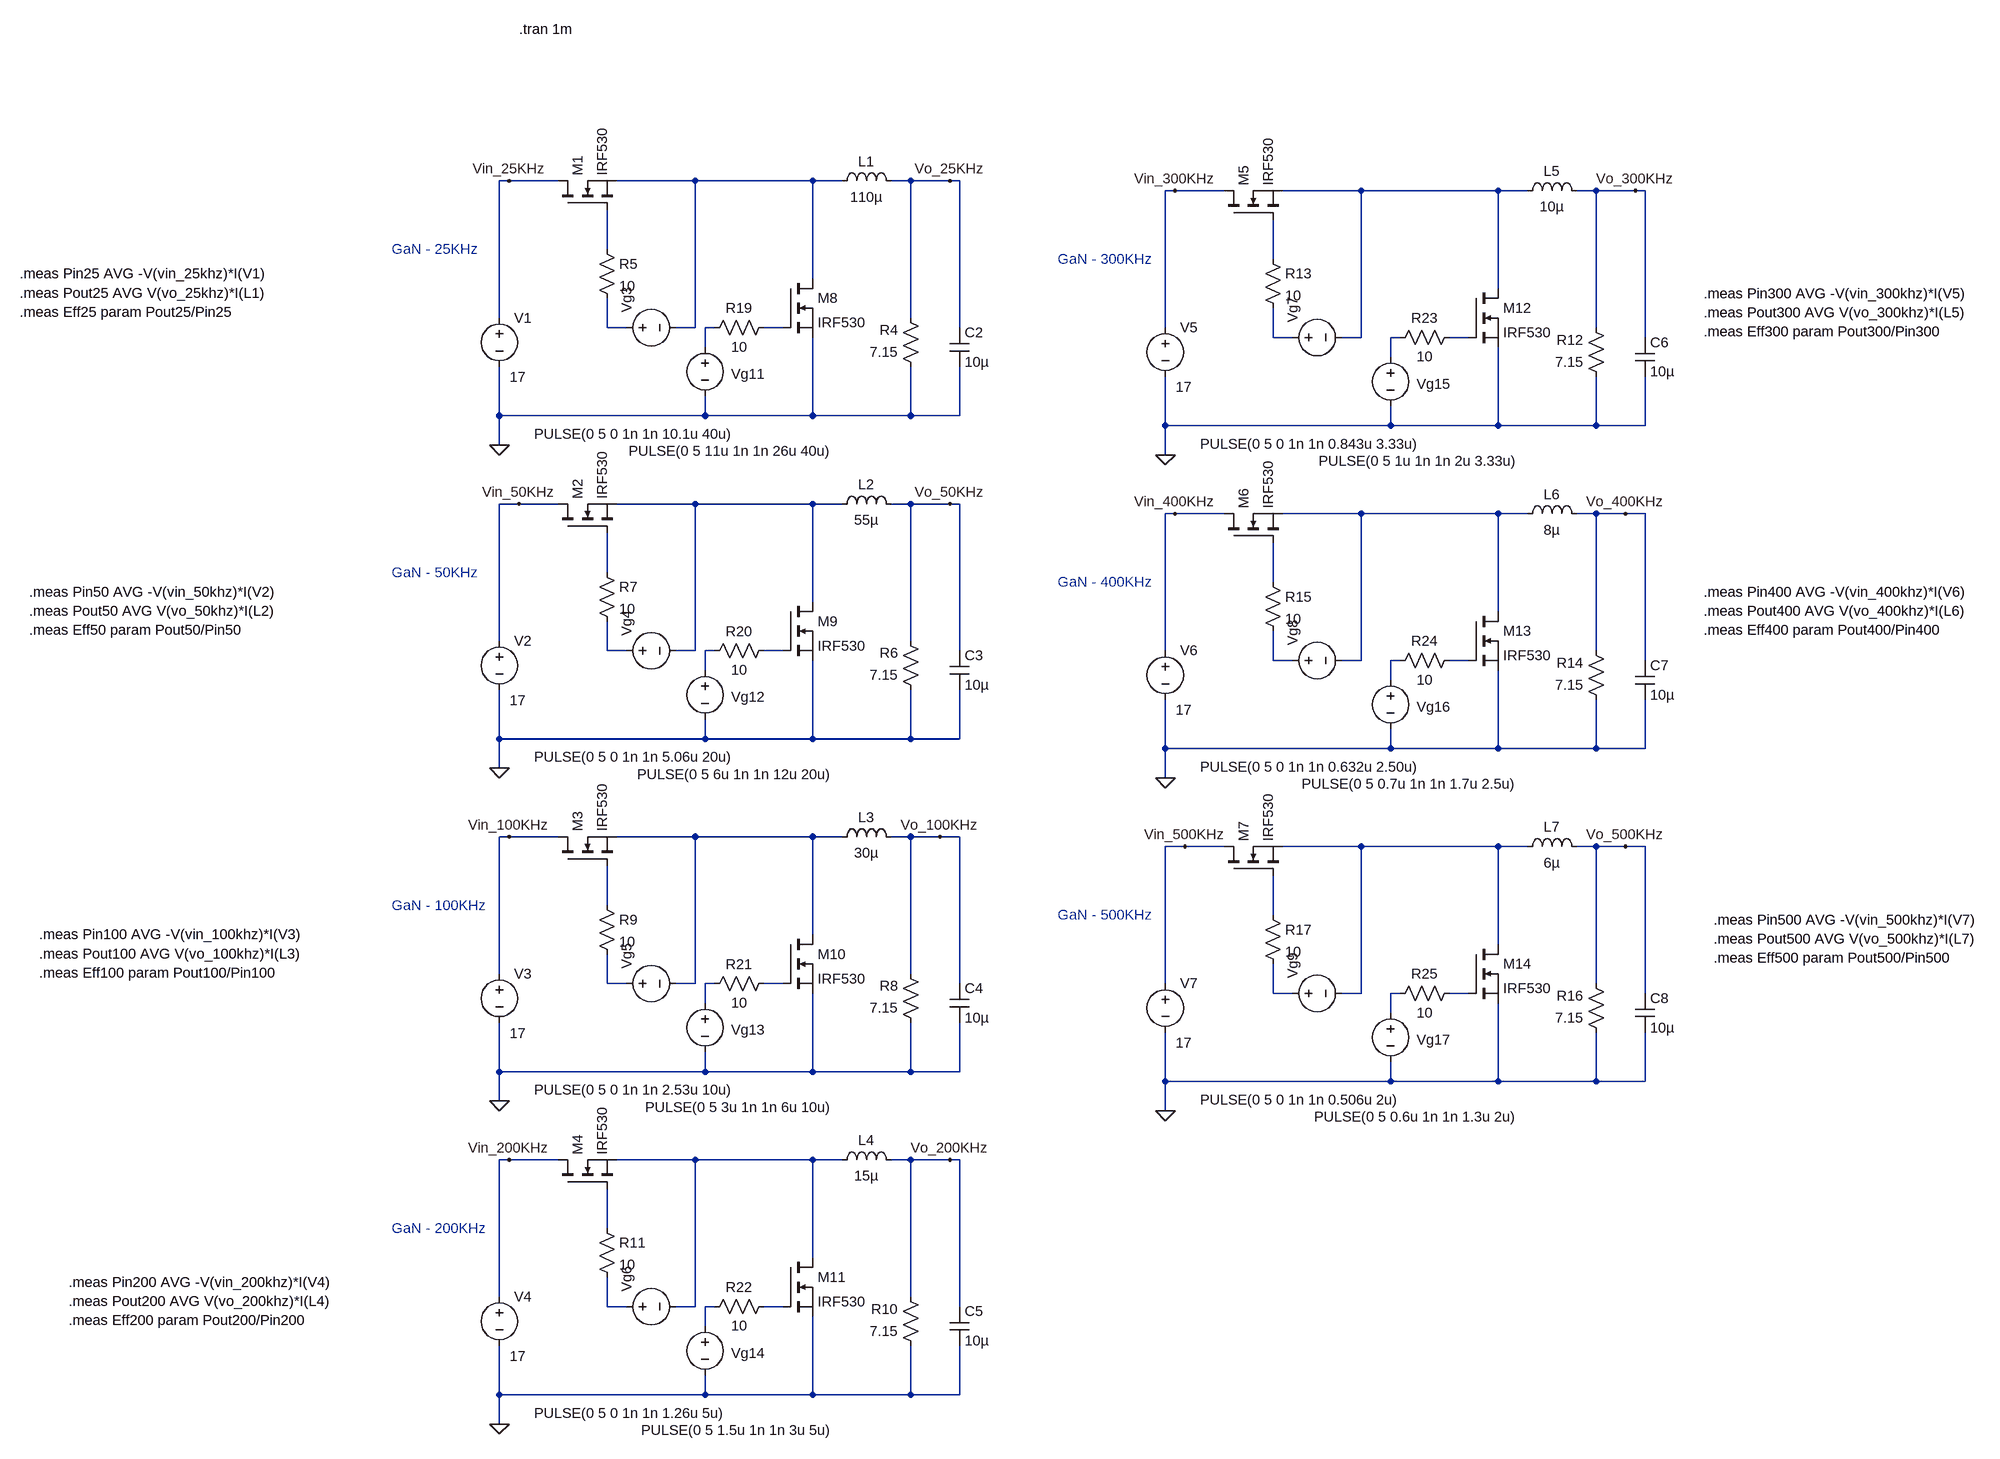
[diagram p0: schematic 2xIRF530.asc]
2xIRF530.asc, the LTspice schematic file:
Version 4
SHEET 1 3084 1916
WIRE 640 -144 624 -144
WIRE 720 -144 640 -144
WIRE 944 -144 816 -144
WIRE 1136 -144 944 -144
WIRE 1184 -144 1136 -144
WIRE 1296 -144 1264 -144
WIRE 1360 -144 1296 -144
WIRE 1376 -144 1360 -144
WIRE 1728 -128 1712 -128
WIRE 1808 -128 1728 -128
WIRE 2032 -128 1904 -128
WIRE 2256 -128 2032 -128
WIRE 2304 -128 2256 -128
WIRE 2416 -128 2384 -128
WIRE 2480 -128 2416 -128
WIRE 2496 -128 2480 -128
WIRE 800 -32 800 -96
WIRE 1888 -16 1888 -80
WIRE 1136 16 1136 -144
WIRE 2256 32 2256 -128
WIRE 624 80 624 -144
WIRE 1296 80 1296 -144
WIRE 800 96 800 48
WIRE 832 96 800 96
WIRE 944 96 944 -144
WIRE 944 96 912 96
WIRE 976 96 960 96
WIRE 1088 96 1056 96
WIRE 1376 96 1376 -144
WIRE 1712 96 1712 -128
WIRE 2416 96 2416 -128
WIRE 1888 112 1888 64
WIRE 1920 112 1888 112
WIRE 2032 112 2032 -128
WIRE 2032 112 2000 112
WIRE 2096 112 2080 112
WIRE 2208 112 2176 112
WIRE 2496 112 2496 -128
WIRE 960 128 960 96
WIRE 2080 144 2080 112
WIRE 624 240 624 160
WIRE 960 240 960 208
WIRE 960 240 624 240
WIRE 1136 240 1136 112
WIRE 1136 240 960 240
WIRE 1296 240 1296 160
WIRE 1296 240 1136 240
WIRE 1376 240 1376 160
WIRE 1376 240 1296 240
WIRE 1712 256 1712 176
WIRE 2080 256 2080 224
WIRE 2080 256 1712 256
WIRE 2256 256 2256 128
WIRE 2256 256 2080 256
WIRE 2416 256 2416 176
WIRE 2416 256 2256 256
WIRE 2496 256 2496 176
WIRE 2496 256 2416 256
WIRE 624 288 624 240
WIRE 1712 304 1712 256
WIRE 656 384 624 384
WIRE 720 384 656 384
WIRE 944 384 816 384
WIRE 1136 384 944 384
WIRE 1184 384 1136 384
WIRE 1296 384 1264 384
WIRE 1360 384 1296 384
WIRE 1376 384 1360 384
WIRE 1728 400 1712 400
WIRE 1808 400 1728 400
WIRE 2032 400 1904 400
WIRE 2256 400 2032 400
WIRE 2304 400 2256 400
WIRE 2416 400 2384 400
WIRE 2464 400 2416 400
WIRE 2496 400 2464 400
WIRE 800 496 800 432
WIRE 1888 512 1888 448
WIRE 1136 544 1136 384
WIRE 2256 560 2256 400
WIRE 624 608 624 384
WIRE 1296 608 1296 384
WIRE 800 624 800 576
WIRE 832 624 800 624
WIRE 944 624 944 384
WIRE 944 624 912 624
WIRE 976 624 960 624
WIRE 1088 624 1056 624
WIRE 1376 624 1376 384
WIRE 1712 624 1712 400
WIRE 2416 624 2416 400
WIRE 1888 640 1888 592
WIRE 1920 640 1888 640
WIRE 2032 640 2032 400
WIRE 2032 640 2000 640
WIRE 2096 640 2080 640
WIRE 2208 640 2176 640
WIRE 2496 640 2496 400
WIRE 960 656 960 624
WIRE 2080 672 2080 640
WIRE 624 768 624 688
WIRE 960 768 960 736
WIRE 960 768 624 768
WIRE 1136 768 1136 640
WIRE 1136 768 960 768
WIRE 1296 768 1296 688
WIRE 1296 768 1136 768
WIRE 1376 768 1376 688
WIRE 1376 768 1296 768
WIRE 1712 784 1712 704
WIRE 2080 784 2080 752
WIRE 2080 784 1712 784
WIRE 2256 784 2256 656
WIRE 2256 784 2080 784
WIRE 2416 784 2416 704
WIRE 2416 784 2256 784
WIRE 2496 784 2496 704
WIRE 2496 784 2416 784
WIRE 624 816 624 768
WIRE 1712 832 1712 784
WIRE 640 928 624 928
WIRE 720 928 640 928
WIRE 944 928 816 928
WIRE 1136 928 944 928
WIRE 1184 928 1136 928
WIRE 1296 928 1264 928
WIRE 1344 928 1296 928
WIRE 1376 928 1344 928
WIRE 1744 944 1712 944
WIRE 1808 944 1744 944
WIRE 2032 944 1904 944
WIRE 2256 944 2032 944
WIRE 2304 944 2256 944
WIRE 2416 944 2384 944
WIRE 2464 944 2416 944
WIRE 2496 944 2464 944
WIRE 800 1040 800 976
WIRE 1888 1056 1888 992
WIRE 1136 1088 1136 928
WIRE 2256 1104 2256 944
WIRE 624 1152 624 928
WIRE 1296 1152 1296 928
WIRE 800 1168 800 1120
WIRE 832 1168 800 1168
WIRE 944 1168 944 928
WIRE 944 1168 912 1168
WIRE 976 1168 960 1168
WIRE 1088 1168 1056 1168
WIRE 1376 1168 1376 928
WIRE 1712 1168 1712 944
WIRE 2416 1168 2416 944
WIRE 1888 1184 1888 1136
WIRE 1920 1184 1888 1184
WIRE 2032 1184 2032 944
WIRE 2032 1184 2000 1184
WIRE 2096 1184 2080 1184
WIRE 2208 1184 2176 1184
WIRE 2496 1184 2496 944
WIRE 960 1200 960 1168
WIRE 2080 1216 2080 1184
WIRE 624 1312 624 1232
WIRE 960 1312 960 1280
WIRE 960 1312 624 1312
WIRE 1136 1312 1136 1184
WIRE 1136 1312 960 1312
WIRE 1296 1312 1296 1232
WIRE 1296 1312 1136 1312
WIRE 1376 1312 1376 1232
WIRE 1376 1312 1296 1312
WIRE 1712 1328 1712 1248
WIRE 2080 1328 2080 1296
WIRE 2080 1328 1712 1328
WIRE 2256 1328 2256 1200
WIRE 2256 1328 2080 1328
WIRE 2416 1328 2416 1248
WIRE 2416 1328 2256 1328
WIRE 2496 1328 2496 1248
WIRE 2496 1328 2416 1328
WIRE 624 1360 624 1312
WIRE 1712 1376 1712 1328
WIRE 640 1456 624 1456
WIRE 720 1456 640 1456
WIRE 944 1456 816 1456
WIRE 1136 1456 944 1456
WIRE 1184 1456 1136 1456
WIRE 1296 1456 1264 1456
WIRE 1360 1456 1296 1456
WIRE 1376 1456 1360 1456
WIRE 800 1568 800 1504
WIRE 1136 1616 1136 1456
WIRE 624 1680 624 1456
WIRE 1296 1680 1296 1456
WIRE 800 1696 800 1648
WIRE 832 1696 800 1696
WIRE 944 1696 944 1456
WIRE 944 1696 912 1696
WIRE 976 1696 960 1696
WIRE 1088 1696 1056 1696
WIRE 1376 1696 1376 1456
WIRE 960 1728 960 1696
WIRE 624 1840 624 1760
WIRE 960 1840 960 1808
WIRE 960 1840 624 1840
WIRE 1136 1840 1136 1712
WIRE 1136 1840 960 1840
WIRE 1296 1840 1296 1760
WIRE 1296 1840 1136 1840
WIRE 1376 1840 1376 1760
WIRE 1376 1840 1296 1840
WIRE 624 1888 624 1840
FLAG 624 288 0
FLAG 624 816 0
FLAG 624 1360 0
FLAG 624 1888 0
FLAG 1712 304 0
FLAG 1712 832 0
FLAG 1712 1376 0
FLAG 1360 -144 Vo_25KHz
FLAG 1360 384 Vo_50KHz
FLAG 1344 928 Vo_100KHz
FLAG 1360 1456 Vo_200KHz
FLAG 2464 944 Vo_500KHz
FLAG 2464 400 Vo_400KHz
FLAG 2480 -128 Vo_300KHz
FLAG 640 -144 Vin_25KHz
FLAG 656 384 Vin_50KHz
FLAG 640 928 Vin_100KHz
FLAG 640 1456 Vin_200KHz
FLAG 1728 -128 Vin_300KHz
FLAG 1728 400 Vin_400KHz
FLAG 1744 944 Vin_500KHz
SYMBOL voltage 816 96 R270
WINDOW 3 -174 -135 VRight 2
WINDOW 123 0 0 Left 2
SYMATTR Value PULSE(0 5 0 1n 1n 10.1u 40u)
SYMATTR SpiceLine Rser=2
SYMATTR InstName Vg3
SYMBOL voltage 624 64 R0
WINDOW 123 0 0 Left 2
WINDOW 3 17 113 Left 2
SYMATTR Value 17
SYMATTR SpiceLine Rser=0
SYMATTR InstName V1
SYMBOL ind 1168 -128 R270
WINDOW 0 32 56 VTop 2
WINDOW 3 5 56 VBottom 2
SYMATTR InstName L1
SYMATTR Value 110µ
SYMBOL res 1312 176 R180
WINDOW 0 36 76 Left 2
WINDOW 3 36 40 Left 2
SYMATTR InstName R4
SYMATTR Value 7.15
SYMBOL cap 1360 96 R0
SYMATTR InstName C2
SYMATTR Value 10µ
SYMBOL res 784 -48 R0
SYMATTR InstName R5
SYMATTR Value 10
SYMBOL voltage 816 624 R270
WINDOW 3 -174 -135 VRight 2
WINDOW 123 0 0 Left 2
SYMATTR Value PULSE(0 5 0 1n 1n 5.06u 20u)
SYMATTR SpiceLine Rser=2
SYMATTR InstName Vg4
SYMBOL voltage 624 592 R0
WINDOW 123 0 0 Left 2
WINDOW 3 17 113 Left 2
SYMATTR Value 17
SYMATTR SpiceLine Rser=0
SYMATTR InstName V2
SYMBOL ind 1168 400 R270
WINDOW 0 32 56 VTop 2
WINDOW 3 5 56 VBottom 2
SYMATTR InstName L2
SYMATTR Value 55µ
SYMBOL res 1312 704 R180
WINDOW 0 36 76 Left 2
WINDOW 3 36 40 Left 2
SYMATTR InstName R6
SYMATTR Value 7.15
SYMBOL cap 1360 624 R0
SYMATTR InstName C3
SYMATTR Value 10µ
SYMBOL res 784 480 R0
SYMATTR InstName R7
SYMATTR Value 10
SYMBOL voltage 816 1168 R270
WINDOW 3 -174 -135 VRight 2
WINDOW 123 0 0 Left 2
SYMATTR Value PULSE(0 5 0 1n 1n 2.53u 10u)
SYMATTR SpiceLine Rser=2
SYMATTR InstName Vg5
SYMBOL voltage 624 1136 R0
WINDOW 123 0 0 Left 2
WINDOW 3 17 113 Left 2
SYMATTR Value 17
SYMATTR SpiceLine Rser=0
SYMATTR InstName V3
SYMBOL ind 1168 944 R270
WINDOW 0 32 56 VTop 2
WINDOW 3 5 56 VBottom 2
SYMATTR InstName L3
SYMATTR Value 30µ
SYMBOL res 1312 1248 R180
WINDOW 0 36 76 Left 2
WINDOW 3 36 40 Left 2
SYMATTR InstName R8
SYMATTR Value 7.15
SYMBOL cap 1360 1168 R0
SYMATTR InstName C4
SYMATTR Value 10µ
SYMBOL res 784 1024 R0
SYMATTR InstName R9
SYMATTR Value 10
SYMBOL voltage 816 1696 R270
WINDOW 3 -174 -135 VRight 2
WINDOW 123 0 0 Left 2
SYMATTR Value PULSE(0 5 0 1n 1n 1.26u 5u)
SYMATTR SpiceLine Rser=2
SYMATTR InstName Vg6
SYMBOL voltage 624 1664 R0
WINDOW 123 0 0 Left 2
WINDOW 3 17 113 Left 2
SYMATTR Value 17
SYMATTR SpiceLine Rser=0
SYMATTR InstName V4
SYMBOL ind 1168 1472 R270
WINDOW 0 32 56 VTop 2
WINDOW 3 5 56 VBottom 2
SYMATTR InstName L4
SYMATTR Value 15µ
SYMBOL res 1312 1776 R180
WINDOW 0 36 76 Left 2
WINDOW 3 36 40 Left 2
SYMATTR InstName R10
SYMATTR Value 7.15
SYMBOL cap 1360 1696 R0
SYMATTR InstName C5
SYMATTR Value 10µ
SYMBOL res 784 1552 R0
SYMATTR InstName R11
SYMATTR Value 10
SYMBOL voltage 1904 112 R270
WINDOW 3 -174 -135 VRight 2
WINDOW 123 0 0 Left 2
SYMATTR Value PULSE(0 5 0 1n 1n 0.843u 3.33u)
SYMATTR SpiceLine Rser=2
SYMATTR InstName Vg7
SYMBOL voltage 1712 80 R0
WINDOW 123 0 0 Left 2
WINDOW 3 17 113 Left 2
SYMATTR Value 17
SYMATTR SpiceLine Rser=0
SYMATTR InstName V5
SYMBOL ind 2288 -112 R270
WINDOW 0 32 56 VTop 2
WINDOW 3 5 56 VBottom 2
SYMATTR InstName L5
SYMATTR Value 10µ
SYMBOL res 2432 192 R180
WINDOW 0 36 76 Left 2
WINDOW 3 36 40 Left 2
SYMATTR InstName R12
SYMATTR Value 7.15
SYMBOL cap 2480 112 R0
SYMATTR InstName C6
SYMATTR Value 10µ
SYMBOL res 1872 -32 R0
SYMATTR InstName R13
SYMATTR Value 10
SYMBOL voltage 1904 640 R270
WINDOW 3 -174 -135 VRight 2
WINDOW 123 0 0 Left 2
SYMATTR Value PULSE(0 5 0 1n 1n 0.632u 2.50u)
SYMATTR SpiceLine Rser=2
SYMATTR InstName Vg8
SYMBOL voltage 1712 608 R0
WINDOW 123 0 0 Left 2
WINDOW 3 17 113 Left 2
SYMATTR Value 17
SYMATTR SpiceLine Rser=0
SYMATTR InstName V6
SYMBOL ind 2288 416 R270
WINDOW 0 32 56 VTop 2
WINDOW 3 5 56 VBottom 2
SYMATTR InstName L6
SYMATTR Value 8µ
SYMBOL res 2432 720 R180
WINDOW 0 36 76 Left 2
WINDOW 3 36 40 Left 2
SYMATTR InstName R14
SYMATTR Value 7.15
SYMBOL cap 2480 640 R0
SYMATTR InstName C7
SYMATTR Value 10µ
SYMBOL res 1872 496 R0
SYMATTR InstName R15
SYMATTR Value 10
SYMBOL voltage 1904 1184 R270
WINDOW 3 -174 -135 VRight 2
WINDOW 123 0 0 Left 2
SYMATTR Value PULSE(0 5 0 1n 1n 0.506u 2u)
SYMATTR SpiceLine Rser=2
SYMATTR InstName Vg9
SYMBOL voltage 1712 1152 R0
WINDOW 123 0 0 Left 2
WINDOW 3 17 113 Left 2
SYMATTR Value 17
SYMATTR SpiceLine Rser=0
SYMATTR InstName V7
SYMBOL ind 2288 960 R270
WINDOW 0 32 56 VTop 2
WINDOW 3 5 56 VBottom 2
SYMATTR InstName L7
SYMATTR Value 6µ
SYMBOL res 2432 1264 R180
WINDOW 0 36 76 Left 2
WINDOW 3 36 40 Left 2
SYMATTR InstName R16
SYMATTR Value 7.15
SYMBOL cap 2480 1184 R0
SYMATTR InstName C8
SYMATTR Value 10µ
SYMBOL res 1872 1040 R0
SYMATTR InstName R17
SYMATTR Value 10
SYMBOL voltage 960 112 R0
WINDOW 3 213 186 Right 2
WINDOW 123 0 0 Left 2
WINDOW 0 43 60 Left 2
SYMATTR Value PULSE(0 5 11u 1n 1n 26u 40u)
SYMATTR InstName Vg11
SYMATTR SpiceLine Rser=2
SYMBOL res 1072 80 R90
WINDOW 0 0 56 VBottom 2
WINDOW 3 32 56 VTop 2
SYMATTR InstName R19
SYMATTR Value 10
SYMBOL voltage 960 640 R0
WINDOW 3 213 186 Right 2
WINDOW 123 0 0 Left 2
WINDOW 0 43 60 Left 2
SYMATTR Value PULSE(0 5 6u 1n 1n 12u 20u)
SYMATTR InstName Vg12
SYMATTR SpiceLine Rser=2
SYMBOL res 1072 608 R90
WINDOW 0 0 56 VBottom 2
WINDOW 3 32 56 VTop 2
SYMATTR InstName R20
SYMATTR Value 10
SYMBOL voltage 960 1184 R0
WINDOW 3 213 186 Right 2
WINDOW 123 0 0 Left 2
WINDOW 0 43 60 Left 2
SYMATTR Value PULSE(0 5 3u 1n 1n 6u 10u)
SYMATTR InstName Vg13
SYMATTR SpiceLine Rser=2
SYMBOL res 1072 1152 R90
WINDOW 0 0 56 VBottom 2
WINDOW 3 32 56 VTop 2
SYMATTR InstName R21
SYMATTR Value 10
SYMBOL voltage 960 1712 R0
WINDOW 3 213 186 Right 2
WINDOW 123 0 0 Left 2
WINDOW 0 43 60 Left 2
SYMATTR Value PULSE(0 5 1.5u 1n 1n 3u 5u)
SYMATTR InstName Vg14
SYMATTR SpiceLine Rser=2
SYMBOL res 1072 1680 R90
WINDOW 0 0 56 VBottom 2
WINDOW 3 32 56 VTop 2
SYMATTR InstName R22
SYMATTR Value 10
SYMBOL voltage 2080 128 R0
WINDOW 3 213 186 Right 2
WINDOW 123 0 0 Left 2
WINDOW 0 43 60 Left 2
SYMATTR Value PULSE(0 5 1u 1n 1n 2u 3.33u)
SYMATTR InstName Vg15
SYMATTR SpiceLine Rser=2
SYMBOL res 2192 96 R90
WINDOW 0 0 56 VBottom 2
WINDOW 3 32 56 VTop 2
SYMATTR InstName R23
SYMATTR Value 10
SYMBOL voltage 2080 656 R0
WINDOW 3 213 186 Right 2
WINDOW 123 0 0 Left 2
WINDOW 0 43 60 Left 2
SYMATTR Value PULSE(0 5 0.7u 1n 1n 1.7u 2.5u)
SYMATTR InstName Vg16
SYMATTR SpiceLine Rser=2
SYMBOL res 2192 624 R90
WINDOW 0 0 56 VBottom 2
WINDOW 3 32 56 VTop 2
SYMATTR InstName R24
SYMATTR Value 10
SYMBOL voltage 2080 1200 R0
WINDOW 3 213 186 Right 2
WINDOW 123 0 0 Left 2
WINDOW 0 43 60 Left 2
SYMATTR Value PULSE(0 5 0.6u 1n 1n 1.3u 2u)
SYMATTR InstName Vg17
SYMATTR SpiceLine Rser=2
SYMBOL res 2192 1168 R90
WINDOW 0 0 56 VBottom 2
WINDOW 3 32 56 VTop 2
SYMATTR InstName R25
SYMATTR Value 10
SYMBOL nmos 720 -96 R270
SYMATTR InstName M1
SYMATTR Value IRF530
SYMBOL nmos 720 432 R270
SYMATTR InstName M2
SYMATTR Value IRF530
SYMBOL nmos 720 976 R270
SYMATTR InstName M3
SYMATTR Value IRF530
SYMBOL nmos 720 1504 R270
SYMATTR InstName M4
SYMATTR Value IRF530
SYMBOL nmos 1808 -80 R270
SYMATTR InstName M5
SYMATTR Value IRF530
SYMBOL nmos 1808 448 R270
SYMATTR InstName M6
SYMATTR Value IRF530
SYMBOL nmos 1808 992 R270
SYMATTR InstName M7
SYMATTR Value IRF530
SYMBOL nmos 1088 16 R0
SYMATTR InstName M8
SYMATTR Value IRF530
SYMBOL nmos 1088 544 R0
SYMATTR InstName M9
SYMATTR Value IRF530
SYMBOL nmos 1088 1088 R0
SYMATTR InstName M10
SYMATTR Value IRF530
SYMBOL nmos 1088 1616 R0
SYMATTR InstName M11
SYMATTR Value IRF530
SYMBOL nmos 2208 32 R0
SYMATTR InstName M12
SYMATTR Value IRF530
SYMBOL nmos 2208 560 R0
SYMATTR InstName M13
SYMATTR Value IRF530
SYMBOL nmos 2208 1104 R0
SYMATTR InstName M14
SYMATTR Value IRF530
TEXT 656 -392 Left 2 !.tran 1m
TEXT 448 -32 Left 2 ;GaN - 25KHz
TEXT 448 496 Left 2 ;GaN - 50KHz
TEXT 448 1040 Left 2 ;GaN - 100KHz
TEXT 448 1568 Left 2 ;GaN - 200KHz
TEXT 1536 -16 Left 2 ;GaN - 300KHz
TEXT 1536 512 Left 2 ;GaN - 400KHz
TEXT 1536 1056 Left 2 ;GaN - 500KHz
TEXT -160 8 Left 2 !.meas Pin25 AVG -V(vin_25khz)*I(V1)\n.meas Pout25 AVG V(vo_25khz)*I(L1)\n.meas Eff25 param Pout25/Pin25
TEXT -144 528 Left 2 !.meas Pin50 AVG -V(vin_50khz)*I(V2)\n.meas Pout50 AVG V(vo_50khz)*I(L2)\n.meas Eff50 param Pout50/Pin50
TEXT -128 1088 Left 2 !.meas Pin100 AVG -V(vin_100khz)*I(V3)\n.meas Pout100 AVG V(vo_100khz)*I(L3)\n.meas Eff100 param Pout100/Pin100
TEXT -80 1656 Left 2 !.meas Pin200 AVG -V(vin_200khz)*I(V4)\n.meas Pout200 AVG V(vo_200khz)*I(L4)\n.meas Eff200 param Pout200/Pin200
TEXT 2592 40 Left 2 !.meas Pin300 AVG -V(vin_300khz)*I(V5)\n.meas Pout300 AVG V(vo_300khz)*I(L5)\n.meas Eff300 param Pout300/Pin300
TEXT 2592 528 Left 2 !.meas Pin400 AVG -V(vin_400khz)*I(V6)\n.meas Pout400 AVG V(vo_400khz)*I(L6)\n.meas Eff400 param Pout400/Pin400
TEXT 2608 1064 Left 2 !.meas Pin500 AVG -V(vin_500khz)*I(V7)\n.meas Pout500 AVG V(vo_500khz)*I(L7)\n.meas Eff500 param Pout500/Pin500

The netlist it stands for:
* 2xIRF530.asc
Vg3 N005 N001 PULSE(0 5 0 1n 1n 10.1u 40u) Rser=2
V1 Vin_25KHz 0 17 Rser=0
L1 N001 Vo_25KHz 110µ
R4 0 Vo_25KHz 7.15
C2 Vo_25KHz 0 10µ
R5 N003 N005 10
Vg4 N015 N011 PULSE(0 5 0 1n 1n 5.06u 20u) Rser=2
V2 Vin_50KHz 0 17 Rser=0
L2 N011 Vo_50KHz 55µ
R6 0 Vo_50KHz 7.15
C3 Vo_50KHz 0 10µ
R7 N013 N015 10
Vg5 N025 N021 PULSE(0 5 0 1n 1n 2.53u 10u) Rser=2
V3 Vin_100KHz 0 17 Rser=0
L3 N021 Vo_100KHz 30µ
R8 0 Vo_100KHz 7.15
C4 Vo_100KHz 0 10µ
R9 N023 N025 10
Vg6 N033 N031 PULSE(0 5 0 1n 1n 1.26u 5u) Rser=2
V4 Vin_200KHz 0 17 Rser=0
L4 N031 Vo_200KHz 15µ
R10 0 Vo_200KHz 7.15
C5 Vo_200KHz 0 10µ
R11 N032 N033 10
Vg7 N008 N002 PULSE(0 5 0 1n 1n 0.843u 3.33u) Rser=2
V5 Vin_300KHz 0 17 Rser=0
L5 N002 Vo_300KHz 10µ
R12 0 Vo_300KHz 7.15
C6 Vo_300KHz 0 10µ
R13 N004 N008 10
Vg8 N018 N012 PULSE(0 5 0 1n 1n 0.632u 2.50u) Rser=2
V6 Vin_400KHz 0 17 Rser=0
L6 N012 Vo_400KHz 8µ
R14 0 Vo_400KHz 7.15
C7 Vo_400KHz 0 10µ
R15 N014 N018 10
Vg9 N028 N022 PULSE(0 5 0 1n 1n 0.506u 2u) Rser=2
V7 Vin_500KHz 0 17 Rser=0
L7 N022 Vo_500KHz 6µ
R16 0 Vo_500KHz 7.15
C8 Vo_500KHz 0 10µ
R17 N024 N028 10
Vg11 N006 0 PULSE(0 5 11u 1n 1n 26u 40u) Rser=2
R19 N007 N006 10
Vg12 N016 0 PULSE(0 5 6u 1n 1n 12u 20u) Rser=2
R20 N017 N016 10
Vg13 N026 0 PULSE(0 5 3u 1n 1n 6u 10u) Rser=2
R21 N027 N026 10
Vg14 N034 0 PULSE(0 5 1.5u 1n 1n 3u 5u) Rser=2
R22 N035 N034 10
Vg15 N009 0 PULSE(0 5 1u 1n 1n 2u 3.33u) Rser=2
R23 N010 N009 10
Vg16 N019 0 PULSE(0 5 0.7u 1n 1n 1.7u 2.5u) Rser=2
R24 N020 N019 10
Vg17 N029 0 PULSE(0 5 0.6u 1n 1n 1.3u 2u) Rser=2
R25 N030 N029 10
M1 Vin_25KHz N003 N001 N001 IRF530
M2 Vin_50KHz N013 N011 N011 IRF530
M3 Vin_100KHz N023 N021 N021 IRF530
M4 Vin_200KHz N032 N031 N031 IRF530
M5 Vin_300KHz N004 N002 N002 IRF530
M6 Vin_400KHz N014 N012 N012 IRF530
M7 Vin_500KHz N024 N022 N022 IRF530
M8 N001 N007 0 0 IRF530
M9 N011 N017 0 0 IRF530
M10 N021 N027 0 0 IRF530
M11 N031 N035 0 0 IRF530
M12 N002 N010 0 0 IRF530
M13 N012 N020 0 0 IRF530
M14 N022 N030 0 0 IRF530
.model NMOS NMOS
.model PMOS PMOS
.lib standard.mos
.tran 1m
* GaN - 25KHz
* GaN - 50KHz
* GaN - 100KHz
* GaN - 200KHz
* GaN - 300KHz
* GaN - 400KHz
* GaN - 500KHz
.meas Pin25 AVG -V(vin_25khz)*I(V1)
.meas Pout25 AVG V(vo_25khz)*I(L1)
.meas Eff25 param Pout25/Pin25
.meas Pin50 AVG -V(vin_50khz)*I(V2)
.meas Pout50 AVG V(vo_50khz)*I(L2)
.meas Eff50 param Pout50/Pin50
.meas Pin100 AVG -V(vin_100khz)*I(V3)
.meas Pout100 AVG V(vo_100khz)*I(L3)
.meas Eff100 param Pout100/Pin100
.meas Pin200 AVG -V(vin_200khz)*I(V4)
.meas Pout200 AVG V(vo_200khz)*I(L4)
.meas Eff200 param Pout200/Pin200
.meas Pin300 AVG -V(vin_300khz)*I(V5)
.meas Pout300 AVG V(vo_300khz)*I(L5)
.meas Eff300 param Pout300/Pin300
.meas Pin400 AVG -V(vin_400khz)*I(V6)
.meas Pout400 AVG V(vo_400khz)*I(L6)
.meas Eff400 param Pout400/Pin400
.meas Pin500 AVG -V(vin_500khz)*I(V7)
.meas Pout500 AVG V(vo_500khz)*I(L7)
.meas Eff500 param Pout500/Pin500
.backanno
.end